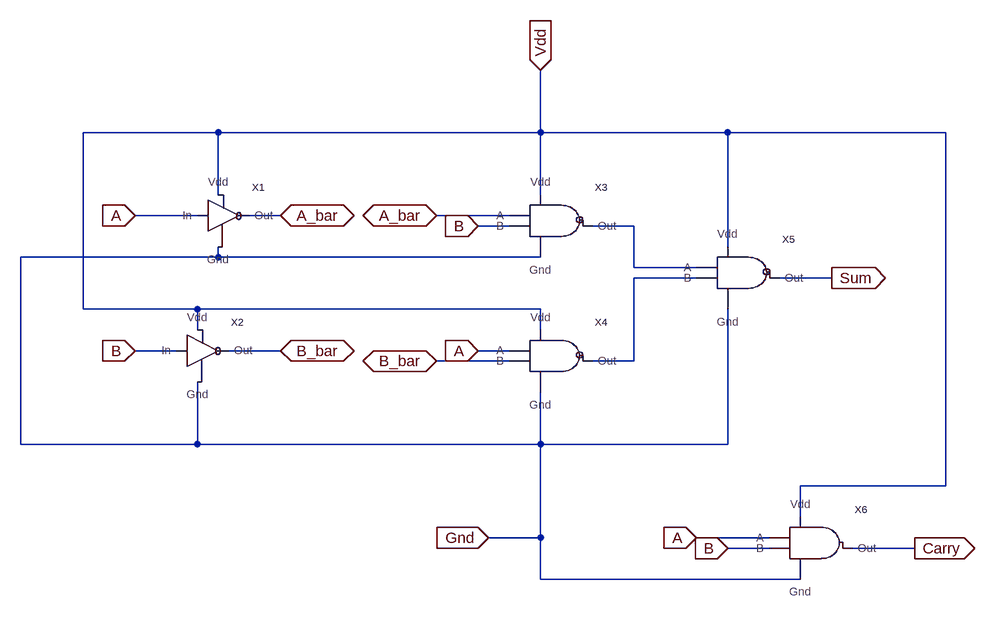
[diagram p0: schematic Half_Adder.asc]
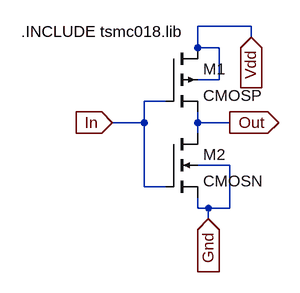
[diagram p1: sub-circuit not.asc]
Half_Adder.asc, the LTspice schematic file:
Version 4
SHEET 1 1124 744
WIRE -112 0 -320 0
WIRE 384 0 384 -96
WIRE 384 0 -112 0
WIRE 672 0 384 0
WIRE 1008 0 672 0
WIRE -112 96 -112 0
WIRE 384 96 384 0
WIRE -144 128 -240 128
WIRE -16 128 -64 128
WIRE 336 128 224 128
WIRE 336 144 288 144
WIRE 528 144 464 144
WIRE 672 176 672 0
WIRE -112 192 -112 176
WIRE -112 192 -416 192
WIRE 384 192 -112 192
WIRE 528 208 528 144
WIRE 624 208 528 208
WIRE 624 224 528 224
WIRE 832 224 752 224
WIRE -320 272 -320 0
WIRE -144 272 -320 272
WIRE 384 272 -144 272
WIRE -144 304 -144 272
WIRE 384 304 384 272
WIRE -176 336 -240 336
WIRE -16 336 -96 336
WIRE 336 336 288 336
WIRE 336 352 224 352
WIRE 528 352 528 224
WIRE 528 352 464 352
WIRE -416 480 -416 192
WIRE -144 480 -144 384
WIRE -144 480 -416 480
WIRE 384 480 384 400
WIRE 384 480 -144 480
WIRE 672 480 672 272
WIRE 672 480 384 480
WIRE 1008 544 1008 0
WIRE 1008 544 784 544
WIRE 784 592 784 544
WIRE 384 624 384 480
WIRE 384 624 304 624
WIRE 736 624 624 624
WIRE 736 640 672 640
WIRE 960 640 864 640
WIRE 384 688 384 624
WIRE 784 688 384 688
FLAG 384 -96 Vdd
IOPIN 384 -96 In
FLAG 304 624 Gnd
IOPIN 304 624 In
FLAG -240 128 A
IOPIN -240 128 In
FLAG -240 336 B
IOPIN -240 336 In
FLAG 288 144 B
IOPIN 288 144 In
FLAG 288 336 A
IOPIN 288 336 In
FLAG 624 624 A
IOPIN 624 624 In
FLAG 672 640 B
IOPIN 672 640 In
FLAG 832 224 Sum
IOPIN 832 224 Out
FLAG 960 640 Carry
IOPIN 960 640 Out
FLAG -16 128 A_bar
IOPIN -16 128 BiDir
FLAG 224 128 A_bar
IOPIN 224 128 BiDir
FLAG -16 336 B_bar
IOPIN -16 336 BiDir
FLAG 224 352 B_bar
IOPIN 224 352 BiDir
SYMBOL NAND 416 176 R0
SYMATTR InstName X3
SYMBOL NAND 416 384 R0
SYMATTR InstName X4
SYMBOL NAND 704 256 R0
SYMATTR InstName X5
SYMBOL AND 816 672 R0
SYMATTR InstName X6
SYMBOL NOT -80 160 R0
SYMATTR InstName X1
SYMBOL NOT -112 368 R0
SYMATTR InstName X2

not.asc, the sub-circuit schematic file:
Version 4
SHEET 1 880 680
WIRE 224 32 144 32
WIRE 224 48 224 32
WIRE 144 64 144 32
WIRE 176 64 144 64
WIRE 176 112 176 64
WIRE 176 112 144 112
WIRE 96 144 64 144
WIRE 64 176 64 144
WIRE 64 176 16 176
WIRE 144 176 144 160
WIRE 192 176 144 176
WIRE 144 192 144 176
WIRE 192 240 144 240
WIRE 64 272 64 176
WIRE 96 272 64 272
WIRE 144 304 144 288
WIRE 160 304 144 304
WIRE 192 304 192 240
WIRE 192 304 160 304
WIRE 160 320 160 304
FLAG 160 320 Gnd
IOPIN 160 320 In
FLAG 192 176 Out
IOPIN 192 176 Out
FLAG 224 48 Vdd
IOPIN 224 48 In
FLAG 16 176 In
IOPIN 16 176 In
SYMBOL cmosp 96 64 R0
SYMATTR InstName M1
SYMATTR Value2 l=180n w=800n
SYMBOL cmosn 96 192 R0
SYMATTR InstName M2
SYMATTR Value2 l=180n w=400n
TEXT -120 40 Left 2 !.INCLUDE tsmc018.lib

The netlist it stands for:
* Half_Adder.asc
XX3 A_bar B Vdd N001 Gnd NAND  ; pins A B Vdd Out Gnd
XX4 A B_bar Vdd N002 Gnd NAND  ; pins A B Vdd Out Gnd
XX5 N001 N002 Vdd Sum Gnd NAND  ; pins A B Vdd Out Gnd
XX6 A B Vdd Carry Gnd AND  ; pins A B Vdd Out Gnd
XX1 A A_bar Vdd Gnd not
XX2 B B_bar Vdd Gnd not

* block symbol definitions
.subckt not In Out Vdd Gnd
M1 Vdd In Out Vdd CMOSP l=180n w=800n
M2 Out In Gnd Gnd CMOSN l=180n w=400n
.INCLUDE tsmc018.lib
.ends not

.model NMOS NMOS
.model PMOS PMOS
.lib standard.mos
.backanno
.end